# EAGLE design LB_BIT_o9_BARGRAPH-v02(rev1) (EAGLE 6.1)
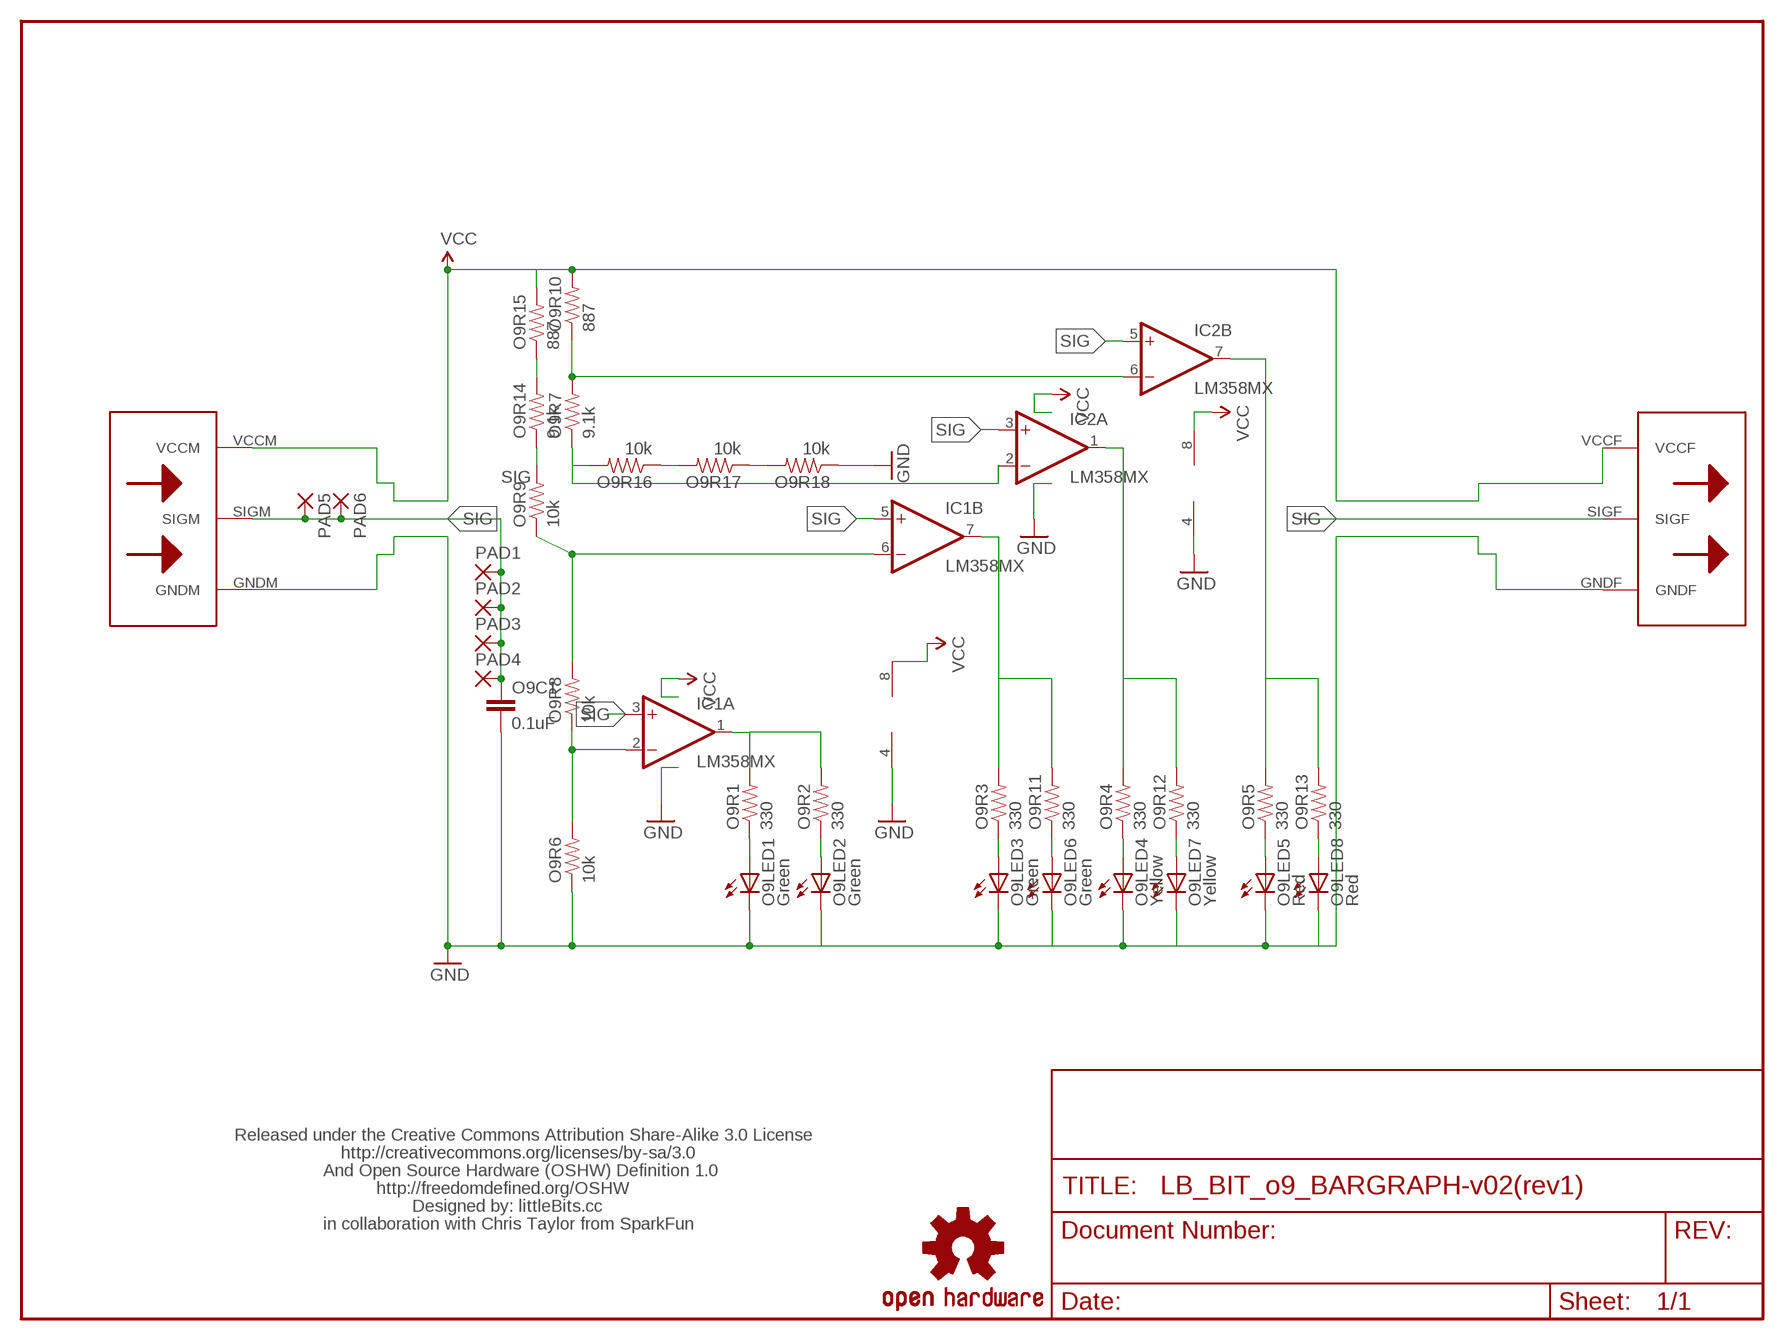
[diagram p0: schematic, sheet 1]

## Parts
IC1  LM358MX  [SO08]
IC2  LM358MX  [SO08]
O9C1  0.1uF  CAP0603-CAP  [0603-CAP]
O9LED1  Green  LED1206  [LED-1206]
O9LED2  Green  LED1206  [LED-1206]
O9LED3  Green  LED1206  [LED-1206]
O9LED4  Yellow  LED1206  [LED-1206]
O9LED5  Red  LED1206  [LED-1206]
O9LED6  Green  LED1206  [LED-1206]
O9LED7  Yellow  LED1206  [LED-1206]
O9LED8  Red  LED1206  [LED-1206]
O9R1  330  RESISTOR  [0805]
O9R2  330  RESISTOR  [0805]
O9R3  330  RESISTOR  [0805]
O9R4  330  RESISTOR  [0805]
O9R5  330  RESISTOR  [0805]
O9R6  10k  RESISTOR  [0805]
O9R7  9.1k  RESISTOR  [0805]
O9R8  10k  RESISTOR  [0805]
O9R9  10k  RESISTOR  [0805]
O9R10  887  RESISTOR  [0805]
O9R11  330  RESISTOR  [0805]
O9R12  330  RESISTOR  [0805]
O9R13  330  RESISTOR  [0805]
O9R14  9.1k  RESISTOR  [0805]
O9R15  887  RESISTOR  [0805]
O9R16  10k  RESISTOR  [0805]
O9R17  10k  RESISTOR  [0805]
O9R18  10k  RESISTOR  [0805]
PAD1  SMD2  [SMD1,27-2,54]
PAD2  SMD2  [SMD1,27-2,54]
PAD3  SMD2  [SMD1,27-2,54]
PAD4  SMD2  [SMD1,27-2,54]
PAD5  SMD2  [SMD1,27-2,54]
PAD6  SMD2  [SMD1,27-2,54]
U$1  LB_CREDITS  [OSHWCREDIT]
U$3  OSHW-LOGOL  [OSHW-LOGO-L]
U$7  BIGBIT  [BIGBIT]

## Nets
GND: IC1.4(P:V-) IC2.4(P:V-) O9C1.2 O9LED1.C O9LED2.C O9LED3.C O9LED4.C O9LED5.C O9LED6.C O9LED7.C O9LED8.C O9R6.1 O9R18.1 U$7.GNDF U$7.GNDM
N$1: IC1.1(A:OUT) O9R1.2 O9R2.2
N$2: O9LED1.A O9R1.1
N$3: O9R14.2 O9R15.1
N$4: O9LED3.A O9R3.1
N$5: O9LED4.A O9R4.1
N$6: O9LED5.A O9R5.1
N$7: O9LED8.A O9R13.1
N$8: O9R9.2 O9R14.1
N$9: O9LED7.A O9R12.1
N$10: O9LED6.A O9R11.1
N$11: IC1.7(B:OUT) O9R3.2 O9R11.2
N$12: IC2.1(A:OUT) O9R4.2 O9R12.2
N$13: IC2.7(B:OUT) O9R5.2 O9R13.2
N$14: IC1.2(A:-IN) O9R6.2 O9R8.1
N$15: IC2.2(A:-IN) O9R7.1 O9R16.2
N$16: IC1.6(B:-IN) O9R8.2 O9R9.1
N$17: O9R16.1 O9R17.2
N$18: O9R17.1 O9R18.2
N$19: O9LED2.A O9R2.1
N$20: IC2.6(B:-IN) O9R7.2 O9R10.1
SIG: IC1.3(A:+IN) IC1.5(B:+IN) IC2.3(A:+IN) IC2.5(B:+IN) O9C1.1 PAD1.1(P) PAD2.1(P) PAD3.1(P) PAD4.1(P) PAD5.1(P) PAD6.1(P) U$7.SIGF U$7.SIGM
VCC: IC1.8(P:V+) IC2.8(P:V+) O9R10.2 O9R15.2 U$7.VCCF U$7.VCCM

## Library data of the parts
IC1 IC2 = linear:LM358: OP AMP also LM158; LM258; LM2904 Source: http://cache.national.com/ds/LM/LM158.pdf
O9C1 = SparkFun:CAP: Capacitor Standard 0603 ceramic capacitor, and 0.1" leaded capacitor.
O9LED1-O9LED8 = SparkFun:LED: LEDs Standard schematic elements and footprints for 5mm, 3mm, 1206, and 0603 sized LEDs. 5mm - Spark Fun Electronics SKU : COM-00529 (and others)
O9R1-O9R18 = SparkFun:RESISTOR: Resistor Basic schematic elements and footprints for 0603, 1206, and PTH 1/10th watt (small) resistors.
PAD1-PAD6 = wirepad:SMD2: SMD PAD
U$1 = LITTLEBITS:LB_CREDITS
U$3 = SparkFun:OSHW-LOGO: Open Source Hardware Logo This logo indicates the piece of hardware it is found on incorporates a OSHW license and/or adheres to the definition of open source hardware found here: http://freedomdefined.org/OSHW
U$7 = bigbits:BIGBIT: BigBit completo Male entra o Sinal Female sai o Sinal Esquerda --> Direita

## Board
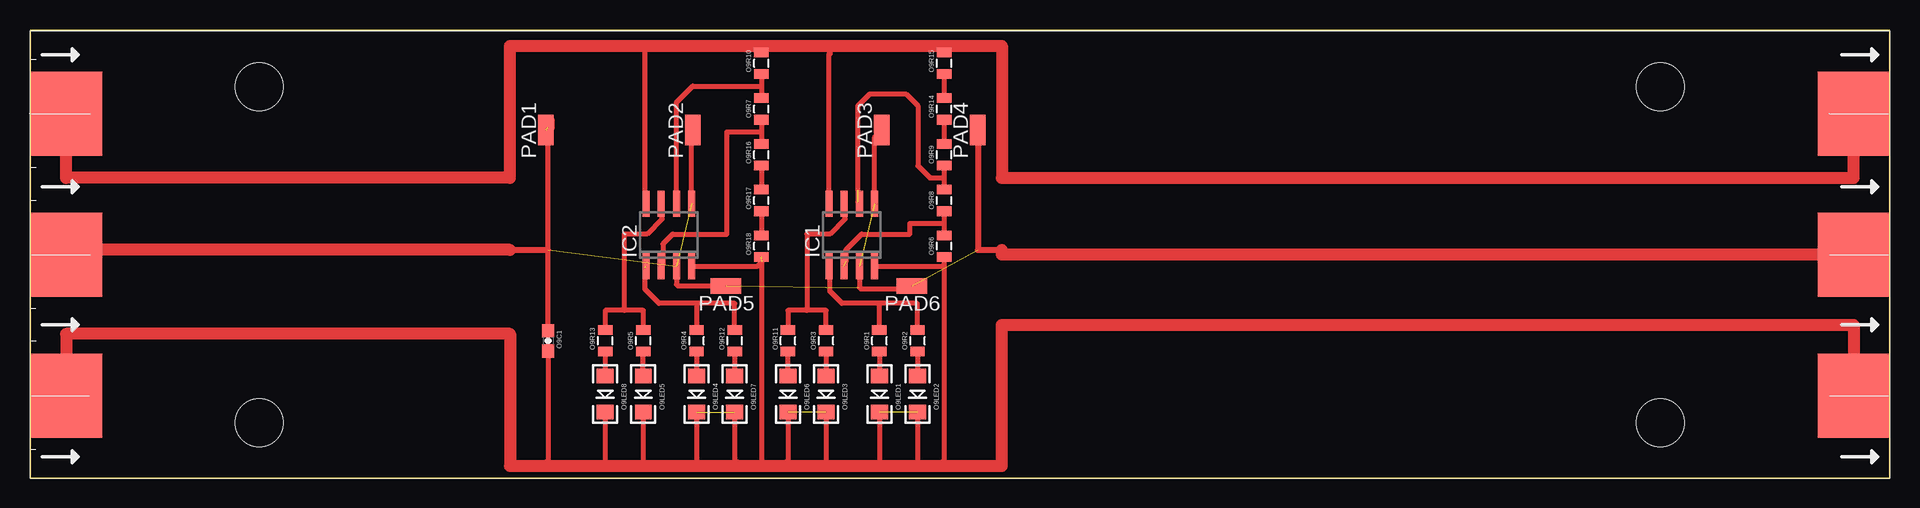
[diagram p1: board, top side]

Size 155.04 x 37.33 mm. Coordinates in mm from the lower left corner, seen from the top.
Outline: 0,0 155.04,0 155.04,37.33 0,37.33 0,0
Copper layers (1*16): Top 0.035mm / dielectric 1.5mm / Bottom 0.035mm
Design rules: minimum track width 10mil, minimum drill 24mil, track to track 8mil, track to pad 8mil, pad to pad 8mil, via to via 8mil, smd to smd 8mil, copper to edge 40mil, drill to drill 8mil, minimum pad ring 10mil, minimum via ring 8mil, stop-mask expansion 4mil, vias tented up to drill 0mil, thermal gap 10mil

### Footprints (pad centres in the part's own frame; a part is rotated, then mirrored left to right if it is on the bottom)
SO08 = smd 0.6 x 2.2: 1 -1.905,-2.6; 2 -0.635,-2.6; 3 0.635,-2.6; 4 1.905,-2.6; 5 1.905,2.6; 6 0.635,2.6; 7 -0.635,2.6; 8 -1.905,2.6
0603-CAP = smd 1.1 x 1: 1 -0.85,0; 2 0.85,0
LED-1206 = smd 1.2 x 1.4: A -1.5,0; C 1.5,0
0805 = smd 0.8 x 1.2: 1 -0.9,0; 2 0.9,0
SMD1,27-2,54 = smd 1.27 x 2.54: 1 0,0
BIGBIT = smd 6 x 7: GNDF 152,-30.38; GNDM 3,-30.38; SIGF 152,-18.64; SIGM 3,-18.64; VCCF 152,-6.89; VCCM 3,-6.89 | hole 4: 135.9,-4.64; 135.9,-32.639; 19.1,-4.64; 19.1,-32.639

### Placement (x,y rotation side)
IC1  68.5,20.25 0 top
IC2  53.25,20.25 0 top
O9C1  43.18,11.43 270 top
O9LED1  70.8,6.99 270 top
O9LED2  73.98,6.99 270 top
O9LED3  66.36,6.99 270 top
O9LED4  55.56,6.99 270 top
O9LED5  51.12,6.99 270 top
O9LED6  63.18,6.99 270 top
O9LED7  58.74,6.99 270 top
O9LED8  47.94,6.99 270 top
O9R1  70.8,11.43 90 top
O9R2  73.98,11.43 90 top
O9R3  66.36,11.43 90 top
O9R4  55.56,11.43 90 top
O9R5  51.12,11.43 90 top
O9R6  76.2,19.32 90 top
O9R7  60.96,30.75 90 top
O9R8  76.2,23.13 90 top
O9R9  76.2,26.94 90 top
O9R10  60.96,34.56 90 top
O9R11  63.18,11.43 90 top
O9R12  58.74,11.43 90 top
O9R13  47.94,11.43 90 top
O9R14  76.2,30.75 90 top
O9R15  76.2,34.56 90 top
O9R16  60.96,26.94 90 top
O9R17  60.96,23.13 90 top
O9R18  60.96,19.32 90 top
PAD1  43,29 0 top
PAD2  55.25,29 0 top
PAD3  71,29 0 top
PAD4  79,29 0 top
PAD5  58,16 90 top
PAD6  73.5,16 90 top
U$1  -48.26,1.27 0 top  (outside the outline)
U$3  -31.75,30.48 0 top  (outside the outline)
U$7  0,37.25 0 top

### Tracks (layer width: path | path; a pad name or v marks a point on that pad's centre or on a via)
GND  (4 unrouted)
  Top 0.406: O9C1.2 43.18,1.27 | O9R18.1 60.96,1.27 | O9R6.1 76.2,17.78 | 76.2,17.78 76.2,1.27 | 76.2,17.78 76.07,17.65 IC1.4 | O9LED8.C 47.94,1.27 | O9LED5.C 51.12,1.27 | O9LED4.C 55.56,1.27 | O9LED7.C 58.74,1.27 | O9LED6.C 63.18,1.27 | O9LED3.C 66.36,1.27 | O9LED1.C 70.8,1.27 | O9LED2.C 73.98,1.27 | IC2.4 60.65,17.65 61,18
  Top 0.5: 43.18,1.27 43,1.27 43,1 | 47.94,1.27 48,1.27 48,1 | 51.12,1.27 51,1.27 51,1 | 58.74,1.27 59,1.27 59,1 | 63.18,1.27 63,1.27 63,1 | 60.96,1.27 61,1.27 61,1 | 73.98,1.27 74,1.27 74,1 | 76.2,1.27 76,1.27 76,1
  Top 1: U$7.GNDF 152,12.75 81,12.75 81,1 76,1 74,1 63,1 61,1 59,1 51,1 48,1 43,1 40,1 40,12 3,12 U$7.GNDM
N$1
  Top 0.406: O9R1.2 70.8,14.56 | O9R2.2 73.98,14.56 70.8,14.56 | IC1.1 66.67,17.57 66.67,15.56 67.67,14.56 70.8,14.56
N$2
  Top 0.406: O9R1.1 O9LED1.A
N$3
  Top 0.406: O9R15.1 O9R14.2
N$4
  Top 0.406: O9R3.1 O9LED3.A
N$5
  Top 0.406: O9R4.1 O9LED4.A
N$6
  Top 0.406: O9LED5.A O9R5.1
N$7
  Top 0.406: O9R13.1 O9LED8.A
N$8
  Top 0.406: O9R14.1 O9R9.2
N$9
  Top 0.406: O9R12.1 O9LED7.A
N$10
  Top 0.406: O9LED6.A O9R11.1
N$11
  Top 0.406: O9R3.2 66.36,13.97 64.77,13.97 | 64.77,13.97 64.77,20.32 66.67,20.32 67.94,21.59 67.94,22.77 IC1.7 | 64.77,13.97 63.18,13.97 O9R11.2
N$12  (1 unrouted)
  Top 0.406: 55.56,14.56 O9R4.2 | O9R12.2 58.74,14.56 55.56,14.56 | 55.56,14.56 52.44,14.56 51.25,15.74 51.25,17.5
N$13
  Top 0.406: O9R5.2 51.12,13.97 49.53,13.97 | O9R13.2 47.94,13.97 49.53,13.97 | 49.53,13.97 49.53,20.32 51.44,20.32 52.7,21.59 52.7,22.76 IC2.7
N$14  (1 unrouted)
  Top 0.406: O9R8.1 76.2,21.23 | 76.2,21.23 O9R6.2 | 76.2,21.23 73.34,21.23 73.34,20.32 69.32,20.32 68,19 68,18
N$15
  Top 0.406: O9R7.1 60.96,28.84 | 60.96,28.84 O9R16.2 | 60.96,28.84 58.1,28.84 58.1,20.32 53.57,20.32 52.75,19.5 52.75,17.79 IC2.2
N$16  (1 unrouted)
  Top 0.406: O9R9.1 76.2,25 | 76.2,25 O9R8.2 | 69,22.98 IC1.6 | 69,24 69,31 70,32 73,32 74,31 74,26 75,25 76.2,25
N$17
  Top 0.406: O9R16.1 O9R17.2
N$18
  Top 0.406: O9R17.1 O9R18.2
N$19
  Top 0.406: O9R2.1 O9LED2.A
N$20
  Top 0.406: O9R10.1 60.96,32.66 | 60.96,32.66 O9R7.2 | 60.96,32.66 55.24,32.66 53.88,31.3 IC2.6
N$21
  Top 1.016: 43.25,29.25 43.25,29.75
N$24
  Top 1.016: 79,29.25 79,29.75
SIG  (6 unrouted)
  Top 0.406: O9C1.1 43.18,19 43.18,29.21 | IC2.3 53.88,16.11 54,16 PAD5.1 | IC2.5 55.16,28.91 PAD2.1 | IC1.5 70.41,28.41 PAD3.1 | IC1.3 69.14,15.87 69.25,15.75 73.25,15.75 PAD6.1
  Top 0.5: 40,19 43.18,19 | PAD4.1 79,19 81,19
  Top 1: 5,19.19 3,19 | 40,19 3,19 | 3,19 U$7.SIGM | U$7.SIGF 81,18.61 81,19
VCC
  Top 0.4: 76.2,36 O9R15.2
  Top 0.406: IC2.8 51.25,22.85 51.25,36 | IC1.8 66.59,35.29 66.67,35.37
  Top 0.5: 66.67,35.37 66.67,35.67 68,36 | O9R10.2 61,35.46 61,36 | 51.44,35.87 51,35.87 51,36
  Top 1: U$7.VCCF 152,25 81,25 81,36 76.2,36 68,36 61,36 51.25,36 51,36 40,36 40,25 3,25 U$7.VCCM